# Altium schematic sheet PSFB_top_level.SchDoc
size 420 x 297 mm
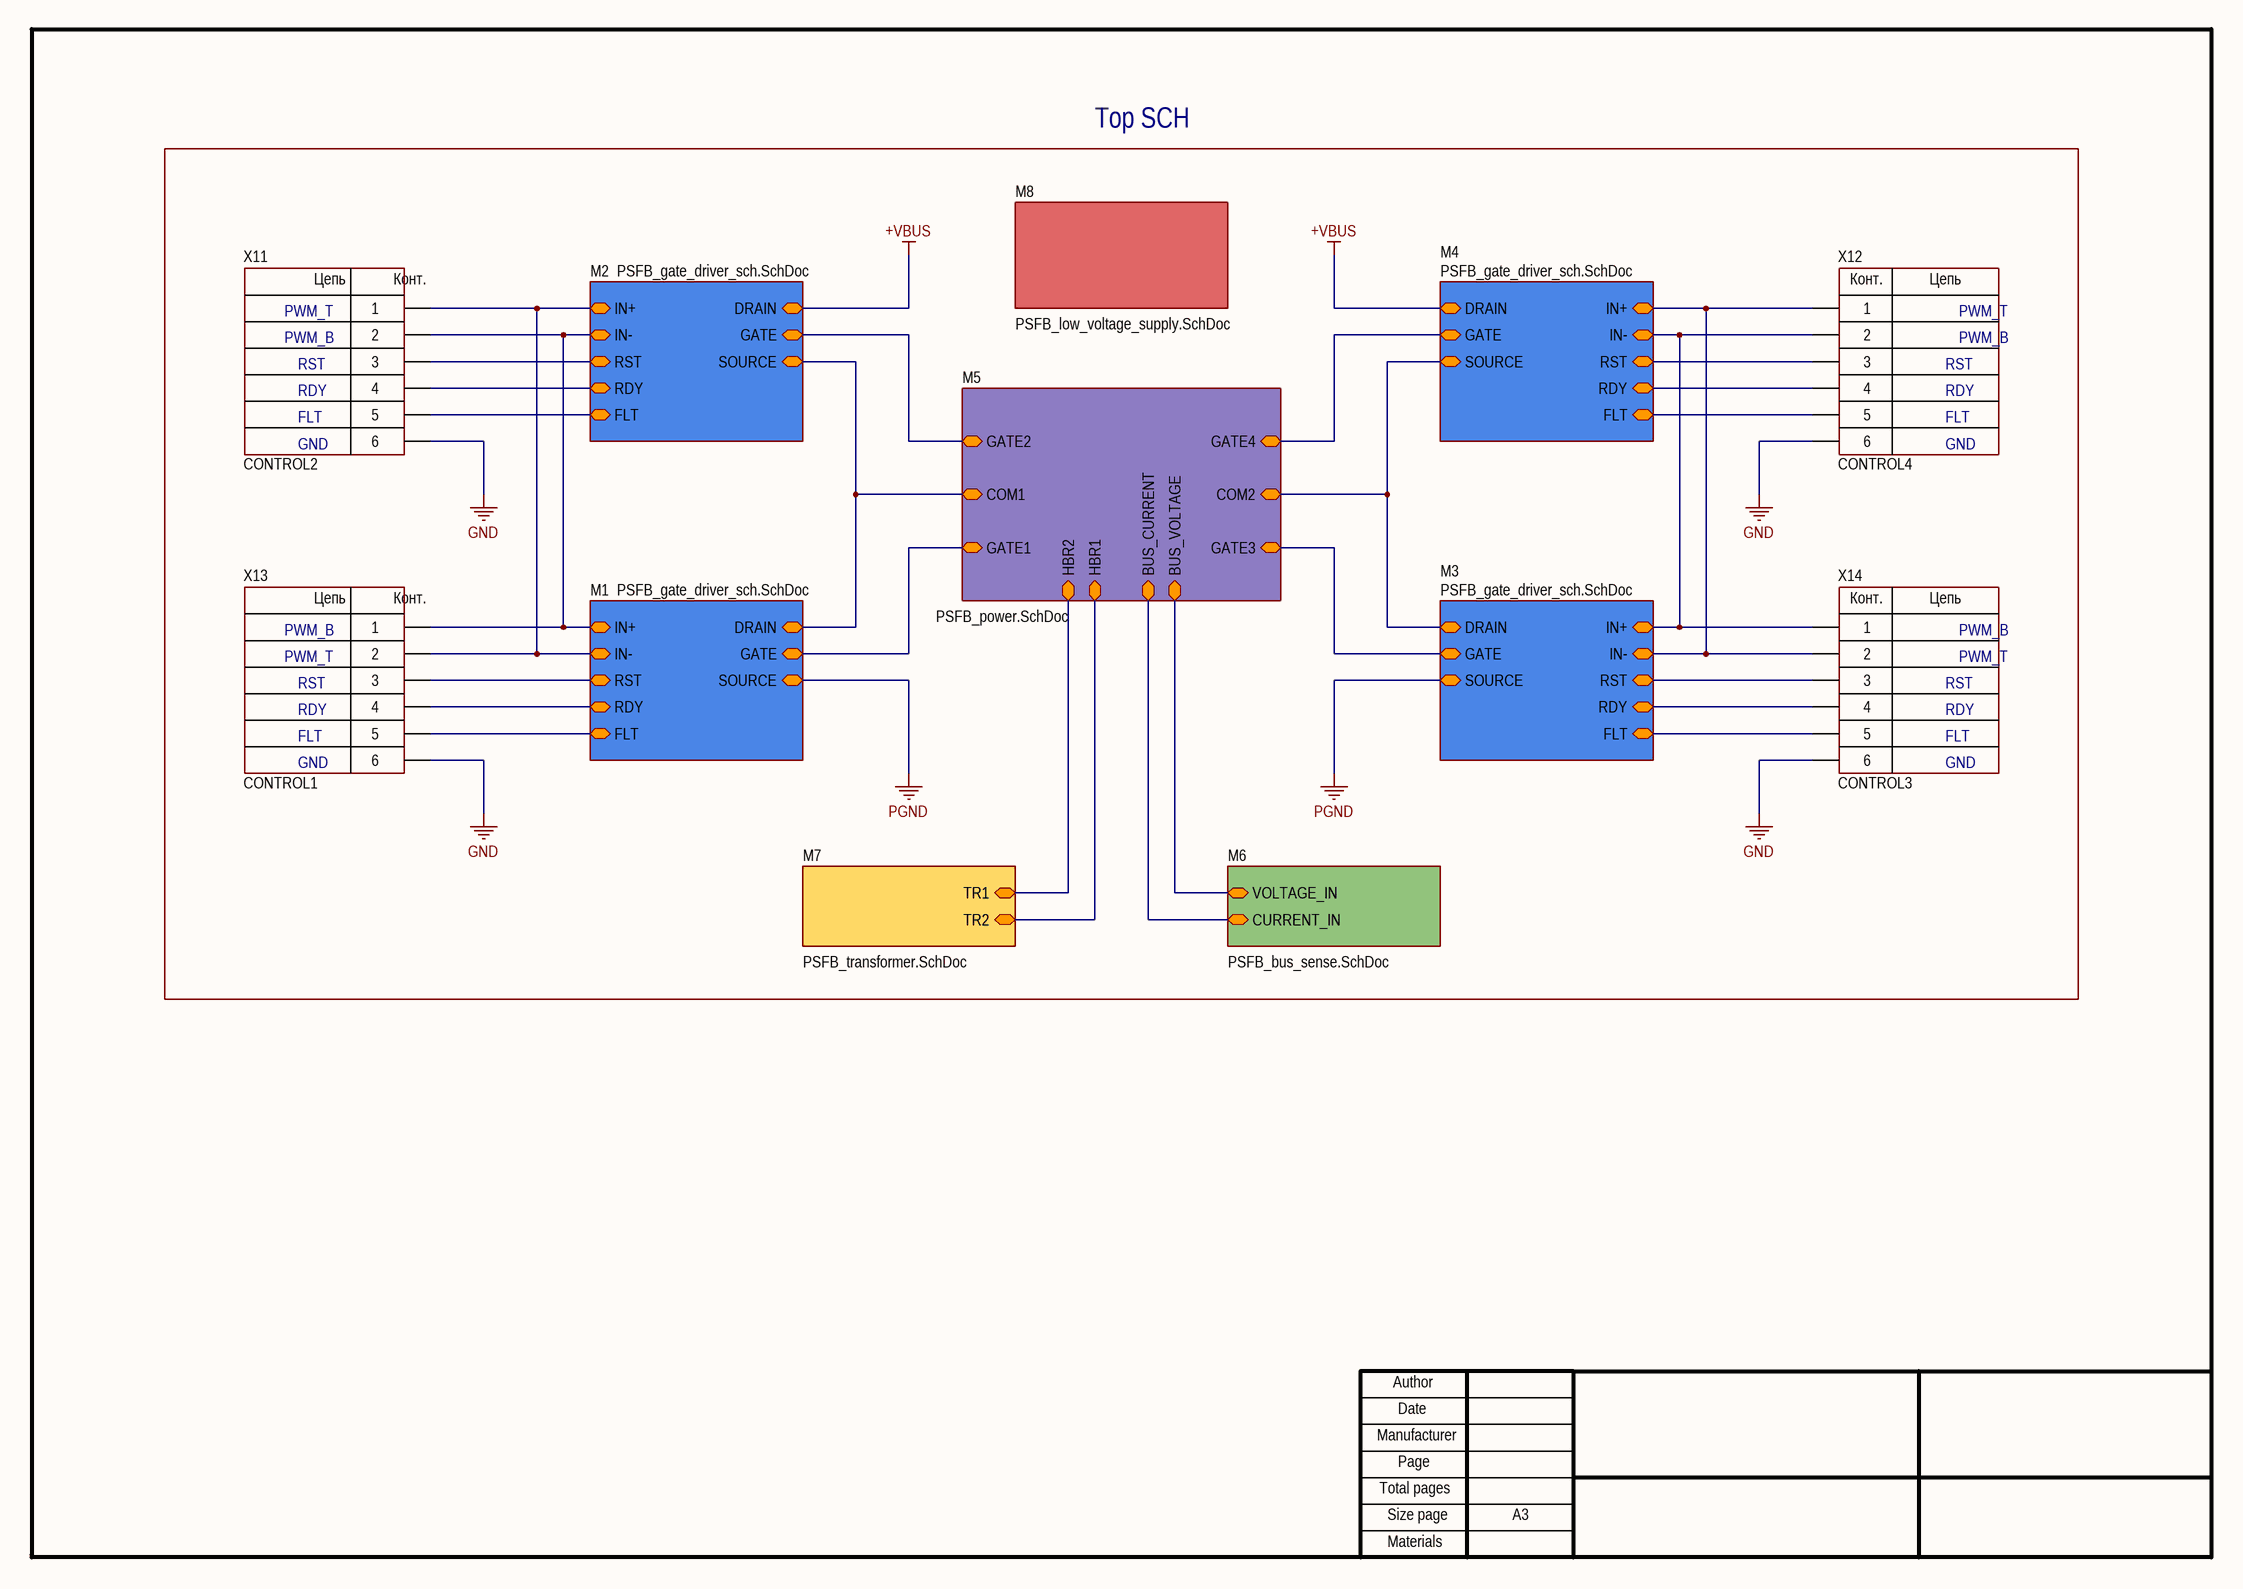
[diagram p0: PSFB_top_level.SchDoc]

## Parts
X11  CommentText: CONTROL2  [CON: SM06B-GHS]
X12  CommentText: CONTROL4  [CON: SM06B-GHS]
X13  CommentText: CONTROL1  [CON: SM06B-GHS]
X14  CommentText: CONTROL3  [CON: SM06B-GHS]

## Sub-sheets
M1 = PSFB_gate_driver_sch.SchDoc: RST (bidir), IN+ (bidir), RDY (bidir), FLT (bidir), IN- (bidir), GATE (bidir), SOURCE (bidir), DRAIN (bidir)
M2 = PSFB_gate_driver_sch.SchDoc: RST (bidir), IN+ (bidir), RDY (bidir), FLT (bidir), IN- (bidir), GATE (bidir), SOURCE (bidir), DRAIN (bidir)
M3 = PSFB_gate_driver_sch.SchDoc: RST (bidir), IN+ (bidir), RDY (bidir), FLT (bidir), IN- (bidir), GATE (bidir), SOURCE (bidir), DRAIN (bidir)
M4 = PSFB_gate_driver_sch.SchDoc: RST (bidir), IN+ (bidir), RDY (bidir), FLT (bidir), IN- (bidir), GATE (bidir), SOURCE (bidir), DRAIN (bidir)
M5 = PSFB_power.SchDoc: GATE1 (bidir), GATE2 (bidir), GATE3 (bidir), GATE4 (bidir), COM1 (bidir), COM2 (bidir), HBR1 (bidir), BUS_VOLTAGE (bidir), BUS_CURRENT (bidir), HBR2 (bidir)
M6 = PSFB_bus_sense.SchDoc: VOLTAGE_IN (bidir), CURRENT_IN (bidir)
M7 = PSFB_transformer.SchDoc: TR1 (bidir), TR2 (bidir)
M8 = PSFB_low_voltage_supply.SchDoc: no entries

## Nets
+VBUS: sheet M2/DRAIN, sheet M4/DRAIN
GND: X11.6 X12.6 X13.6 X14.6
PGND: sheet M1/SOURCE, sheet M3/SOURCE
NetX11_1: X11.1 X13.2 ; sheet M1/IN-, sheet M2/IN+
NetX11_2: X11.2 X13.1 ; sheet M1/IN+, sheet M2/IN-
NetX11_3: X11.3 ; sheet M2/RST
NetX11_4: X11.4 ; sheet M2/RDY
NetX11_5: X11.5 ; sheet M2/FLT
NetX12_1: X12.1 X14.2 ; sheet M3/IN-, sheet M4/IN+
NetX12_2: X12.2 X14.1 ; sheet M3/IN+, sheet M4/IN-
NetX12_3: X12.3 ; sheet M4/RST
NetX12_4: X12.4 ; sheet M4/RDY
NetX12_5: X12.5 ; sheet M4/FLT
NetX13_3: X13.3 ; sheet M1/RST
NetX13_4: X13.4 ; sheet M1/RDY
NetX13_5: X13.5 ; sheet M1/FLT
NetX14_3: X14.3 ; sheet M3/RST
NetX14_4: X14.4 ; sheet M3/RDY
NetX14_5: X14.5 ; sheet M3/FLT
(unnamed): sheet M6/VOLTAGE_IN, sheet M5/BUS_VOLTAGE
(unnamed): sheet M6/CURRENT_IN, sheet M5/BUS_CURRENT
(unnamed): sheet M1/GATE, sheet M5/GATE1
(unnamed): sheet M1/DRAIN, sheet M5/COM1, sheet M2/SOURCE
(unnamed): sheet M5/GATE2, sheet M2/GATE
(unnamed): sheet M5/GATE3, sheet M3/GATE
(unnamed): sheet M5/GATE4, sheet M4/GATE
(unnamed): sheet M5/COM2, sheet M3/DRAIN, sheet M4/SOURCE
(unnamed): sheet M5/HBR1, sheet M7/TR2
(unnamed): sheet M5/HBR2, sheet M7/TR1

## Notes on the sheet
- Top SCH
- PWM_T
- PWM_B
- RST
- RDY
- FLT
- GND
- Author
- Manufacturer
- Date
- Page
- Total pages
- Size page
- A3
- Materials
- (in symbol Connector_SM06B) Цепь; Конт.

## Library data of the parts
X11-X14 = Connector_SM06B: Connector Header Surface Mount, Right Angle 6 position 0.039" (1.00mm); Manufacturer: JST; ValueManufacturerPartNumber: Connector, 6pin, 1.25mm, 50VDC, 1A; PartNumber: SM06B-GHS; VoltageMax: 50VDC; Pitch: 1.25mm; CurrentMax: 1A; Multichannel: 6pin; HelpURL: https://www.digikey.com/product-detail/en/jst-sales-america-inc/SM06B-GHS-TB-LF-SN/455-1568-1-ND/807836; TypeConnector: Connector